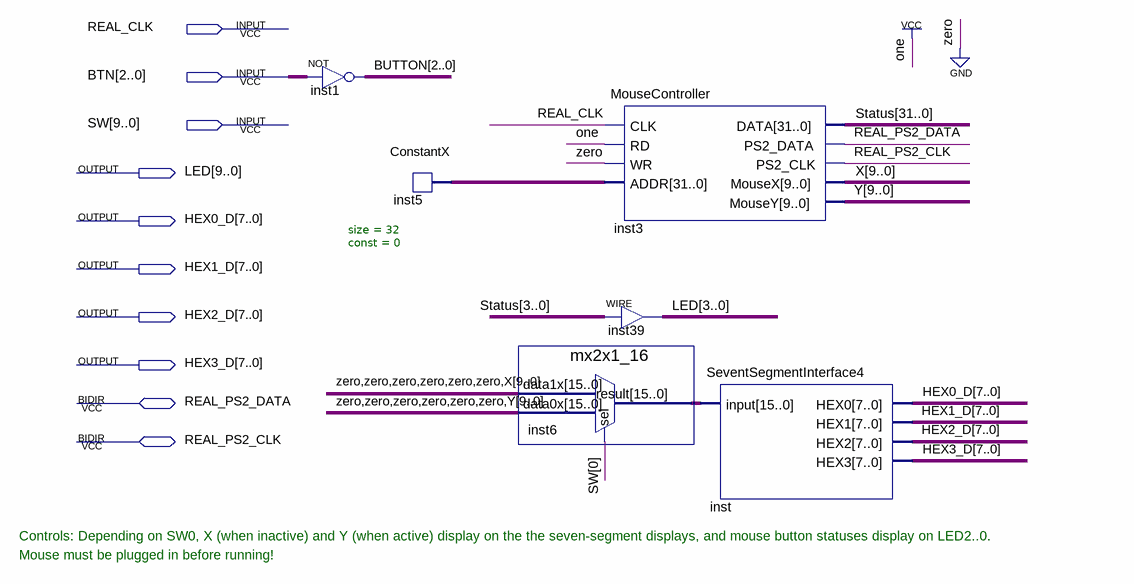
[diagram p0: schematic sheet]
// Quartus schematic MouseTest.bdf as structural Verilog: 6 symbols, 10 pins
module MouseTest (
  input  REAL_CLK,
  input  [2:0] BTN,
  input  [9:0] SW,
  inout  REAL_PS2_DATA,
  inout  REAL_PS2_CLK,
  output [9:0] LED,
  output [7:0] HEX0_D,
  output [7:0] HEX1_D,
  output [7:0] HEX2_D,
  output [7:0] HEX3_D
);

  wire [2:0] BUTTON;
  wire [9:0] X, Y;
  wire [15:0] inst6_result;
  wire [31:0] inst5_data_out, Status;

  assign BUTTON = ~BTN;  // NOT inst1, 3 bits wide
  ConstantX #(.size(32), .\const (0)) inst5 (.DATA_OUT(inst5_data_out));
  mx2x1_16 inst6 (.data1x({{6{1'b0}}, X}), .data0x({{6{1'b0}}, Y}), .sel(SW[0]), .result(inst6_result));
  MouseController inst3 (
    .CLK(REAL_CLK), .RD(1'b1), .WR(1'b0), .ADDR(inst5_data_out), .MouseX(X), .MouseY(Y), .DATA(Status),
    .PS2_DATA(REAL_PS2_DATA), .PS2_CLK(REAL_PS2_CLK));
  assign LED[3:0] = Status[3:0];  // WIRE inst39
  SeventSegmentInterface4 inst (.\input (inst6_result), .HEX0(HEX0_D), .HEX1(HEX1_D), .HEX2(HEX2_D), .HEX3(HEX3_D));

  // Notes on the sheet:
  //   Controls: Depending on SW0, X (when inactive) and Y (when active) display on the the seven-segment displays, and mouse button statuses display on LED2..0.
  //   Mouse must be plugged in before running!
endmodule
